# EasyEDA Pro project ProPrj_MOSSE_2026-03-25.epro, board PCB1
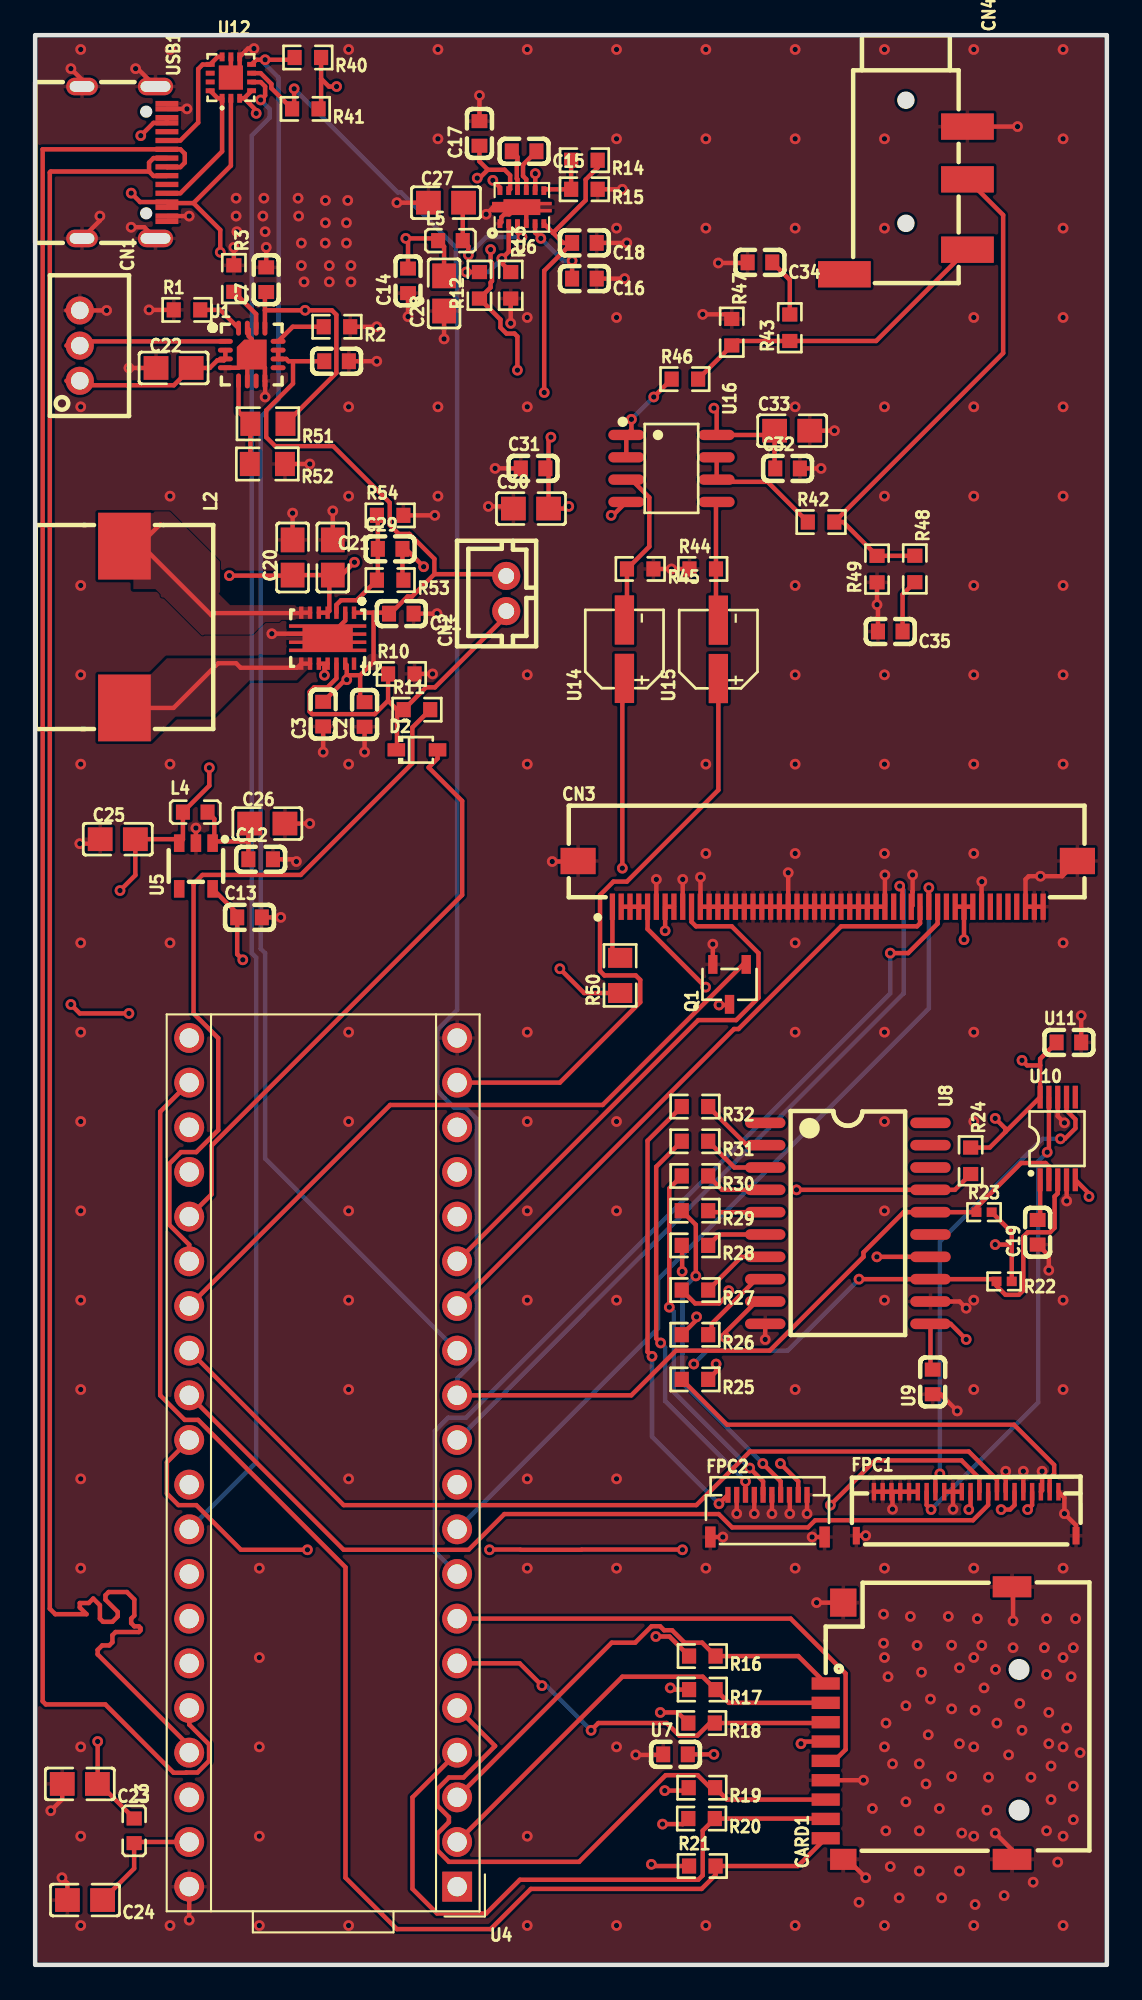
[diagram p9: board, top side]
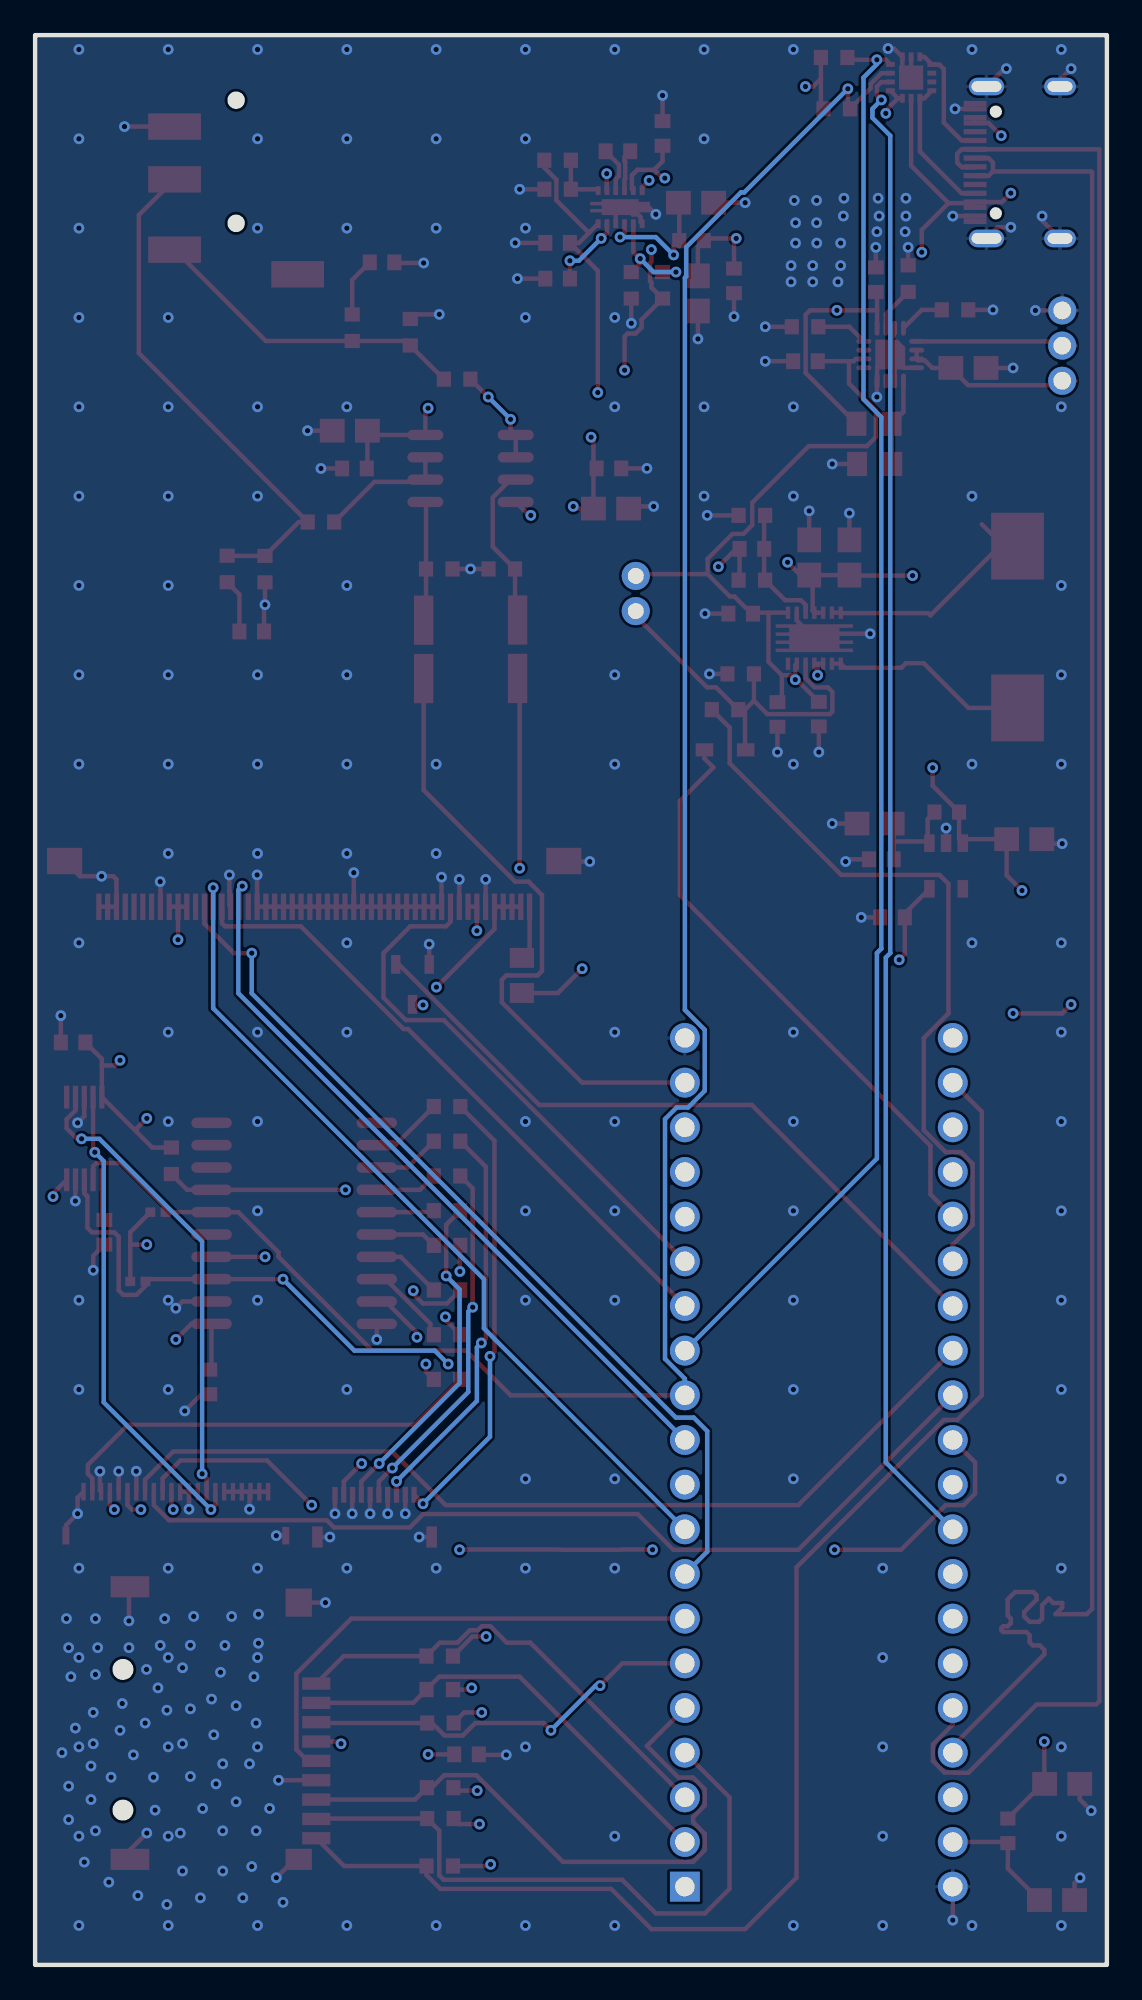
[diagram p10: board, bottom side, seen from below]

Outline 60.96 x 109.73 mm; copper layers: Top Layer, GND, Power, Bottom Layer. Coordinates in mm from the lower left corner of the outline.
Outline path: rectangle 0,109.73 60.96,0
Stack: Top Layer 0.035mm Outer layer thickness 1oz / Dielectric1 0.2104mm 7628 RC49% 8.6mil / GND 0.0152mm Inner layer thickness / Dielectric2 1.065mm 1.1mm H/HOZ Copper / Power 0.0152mm Inner layer thickness / Dielectric3 0.2104mm 7628 RC49% 8.6mil / Bottom Layer 0.035mm Outer layer thickness 1oz

## Design rules (mm)
net VSYS: Power_High
net +5V: Power_5V
net VBAT: Power_High
net $1N3188: Power_5V
net $1N3192: Power_5V
net VBUS: Power_High
net USB_D-: DP1
net USB_D+: DP1
net +3V3_DIGITAL: Power_3V3
net DAT3: SDIO_Bus
net DAT2: SDIO_Bus
net DAT1: SDIO_Bus
net DAT0: SDIO_Bus
net CMD: SDIO_Bus
net CLX: SDIO_Bus
net +4V5_ANALOG: Power_Analog
net -4V5_ANALOG: Power_Analog
net HAP_P: Diff_HAP
net HAP_N: Diff_HAP
net AGND: Ground
net AUDIO_L: Analog_Signal
net AUDIO_R: Analog_Signal
net $6N1003: Analog_Signal
net $6N1101: Analog_Signal
net $6N1422: Analog_Signal
net $6N1376: Analog_Signal
net $6N1353: Analog_Signal
net $6N1437: Analog_Signal
net $6N1331: Analog_Signal
net $6N1693: Analog_Signal
template: Custom Config
spacing copperThickness1oz (default): track to track 0.102, other pairs 0.152 to 0.3
spacing copperThickness2oz: track to track 0.203, other pairs 0.152 to 0.3
track width copperThickness1oz (default): min 0.127, default 0.254, max 2.54
track width copperThickness2oz: min 0.203, default 0.254, max 2.54
differential pair differentialPair (default): width min 0.127, default 0.254, max 2.54; gap min 0.152, default 0.152
via viaSize (default): diameter min 0.5, default 0.61, max 10; hole min 0.3, default 0.305, max 6.3
pour e92046 uses copperRegion

## Placement (name value [footprint] x y rotation side)
C1  4.7uF  [C0603]  17.15 91.19 180 top
C2  10uF  [C0603]  18.74 71.1 90 top
C3  10uF  [C0603]  16.38 71.12 90 top
C7  10uF  [C0603]  13.14 95.82 90 top
C11  100nF  [C0603]  20.83 76.84 180 top
C12  1uF  [C0603]  12.83 62.87 0 top
C13  2.2uF  [C0603]  12.19 59.56 0 top
C14  4.7uF  [C0603]  21.21 95.76 90 top
C15  2.2uF  [C0603]  27.81 103.12 180 top
C16  4.7uF  [C0603]  31.24 95.89 180 top
C17  2.2uF  [C0603]  25.27 104.14 90 top
C18  2.2uF  [C0603]  31.24 97.92 180 top
C19  1uF  [C0603]  57.02 41.66 90 top
C20  22uF  [C0805]  14.64 80.03 90 top
C21  22uF  [C0805]  16.93 80.03 90 top
C22  22uF  [C0805]  7.87 90.81 0 top
C23  10uF  [C0805]  2.54 10.29 180 top
C24  10uF  [C0805]  2.84 3.68 180 top
C25  10uF  [C0805]  4.7 64.01 0 top
C26  10uF  [C0805]  13.21 64.9 0 top
C27  10uF  [C0805]  23.37 100.2 0 top
C28  10uF  [C0805]  23.26 95.04 90 top
C29  10pF  [C0603]  20.19 80.52 0 top
C30  10uF  [C0805]  28.2 82.81 0 top
C31  100nF  [C0603]  28.32 85.09 0 top
C32  100nF  [C0603]  42.8 85.09 0 top
C33  10uF  [C0805]  43.06 87.24 0 top
C34  100nF  [C0603]  41.23 96.81 180 top
C35  100nF  [C0603]  48.64 75.82 180 top
CARD1  TF PUSH  [TF-SMD_TF-PUSH]  50.27 13.75 90 top
CN1  B3B-PH-K-S(LF)(SN)  [CONN-TH_B3B-PH-K-S]  2.54 92.08 270 top
CN2  B2B-PH-K-S(LF)(SN)  [CONN-TH_B2B-PH-K-S]  26.8 77.98 90 top
CN3  KH-FG0.5-H2.0-50PIN  [FPC-SMD_KH-FG0.5-H2.0-50PIN]  45.09 61.47 0 top
CN4  PJ-320D  [AUDIO-SMD_PJ-320D-1]  49.53 100.33 270 top
D2  1N4148WS  [SOD-323_L1.8-W1.3-LS2.5-RD]  21.72 69.09 0 top
FPC1  FH34SRJ-22S-0.5SH(50)  [FFC-SMD_22P-P0.50_HRS_FH34SRJ-22S-0.5SH]  52.96 25.65 0 top
FPC2  FH34SRJ-10S-0.5SH(50)  [FFC-SMD_10P-P0.50_FH34SRJ-10S-0.5SH]  41.66 25.53 0 top
L2  1.5uH  [IND-SMD_CYA1040-100UH]  5.08 76.07 270 top
L3  MPZ1608S102ATA00  [L0603]  5.63 7.62 270 top
L4  MPZ1608S102ATA00  [L0603]  9.11 65.55 0 top
L5  MPZ1608S102ATA00  [L0603]  23.62 98.04 0 top
Q1  AO3400A  [SOT-23-3_L3.0-W1.6-P1.90-LS2.8-BR]  39.5 55.75 90 top
R1  1kΩ  [R0603]  8.64 94.11 0 top
R2  1.13kΩ  [R0603]  17.17 93.15 180 top
R3  47kΩ  [R0603]  11.3 95.89 270 top
R10  220kΩ  [R0603]  20.83 73.41 0 top
R11  10kΩ  [R0603]  21.72 71.37 0 top
R12  274kΩ  [R0603]  25.27 95.5 90 top
R13  100kΩ  [R0603]  27.05 95.5 270 top
R14  270kΩ  [R0603]  31.24 102.62 180 top
R15  100kΩ  [R0603]  31.24 100.97 180 top
R16  10kΩ  [R0603]  37.95 17.56 180 top
R17  10kΩ  [R0603]  37.95 15.65 180 top
R18  10kΩ  [R0603]  37.91 13.75 180 top
R19  10kΩ  [R0603]  37.93 10.07 180 top
R20  10kΩ  [R0603]  37.91 8.32 180 top
R21  10kΩ  [R0603]  37.95 5.62 0 top
R22  2.2kΩ  [R0402]  55.12 38.86 180 top
R23  2.2kΩ  [R0402]  53.97 42.8 0 top
R24  4.7kΩ  [R0603]  53.21 45.72 270 top
R25  4.7kΩ  [R0603]  37.53 33.29 180 top
R26  4.7kΩ  [R0603]  37.53 35.83 180 top
R27  4.7kΩ  [R0603]  37.53 38.37 180 top
R28  4.7kΩ  [R0603]  37.53 40.91 180 top
R29  4.7kΩ  [R0603]  37.53 42.88 180 top
R30  4.7kΩ  [R0603]  37.53 44.86 180 top
R31  4.7kΩ  [R0603]  37.53 46.83 180 top
R32  4.7kΩ  [R0603]  37.53 48.81 180 top
R40  4.7kΩ  [R0603]  15.51 108.46 180 top
R41  4.7kΩ  [R0603]  15.37 105.54 180 top
R42  33Ω  [R0603]  44.7 82.04 0 top
R43  10Ω  [R0603]  42.93 93.09 90 top
R44  100kΩ  [R0603]  37.97 79.38 0 top
R45  100kΩ  [R0603]  34.42 79.38 180 top
R46  33Ω  [R0603]  36.96 90.17 0 top
R47  100kΩ  [R0603]  39.62 92.84 270 top
R48  10Ω  [R0603]  50.04 79.38 270 top
R49  100kΩ  [R0603]  47.89 79.37 90 top
R50  27Ω  [R0805]  33.27 56.26 90 top
R51  100kΩ  [R0805]  13.24 87.63 180 top
R52  33kΩ  [R0805]  13.21 85.34 180 top
R53  1.6MΩ  [R0603]  20.19 78.74 180 top
R54  180kΩ  [R0603]  20.19 82.42 0 top
U1  BQ24075RGTR  [QFN-16_L3.0-W3.0-P0.50-TL-EP1.7]  12.32 91.57 0 top
U2  TPS63020DSJR  [VSON-14_L4.0-W3.0-P0.50-BL-EP_TI_DSJ]  16.64 75.44 180 top
U4  -  [Daisy_Seed]  24 4.45 180 top
U5  AP2112K-3.3TRG1(MS)  [SOT-23-5_L2.9-W1.6-P0.95-LS2.7-BR]  9.14 62.48 90 top
U6  LM27762DSSR  [WSON-12_L3.0-W2.0-P0.50-BL-EP]  27.69 99.95 0 top
U7  100nF  [C0603]  36.43 11.97 0 top
U8  AT42QT2120-SUR  [SOIC-20_L12.8-W7.5-P1.27-LS10.3-BL]  46.23 42.16 270 top
U9  100nF  [C0603]  51.05 33.15 90 top
U10  DRV2605LDGSR  [VSSOP-10_L3.0-W3.0-P0.50-LS4.9-BL]  58.17 46.99 0 top
U11  100nF  [C0603]  58.8 52.45 0 top
U12  Fusb302mpx  [MLP-14_L2.5-W2.5-P0.50-BL-EP]  11.13 107.32 0 top
U14  10uF  [CAP-SMD_BD4.0-L4.3-W4.3-LS5.0-FD]  33.52 74.81 90 top
U15  10uF  [CAP-SMD_BD4.0-L4.3-W4.3-LS5.0-FD]  38.86 74.8 90 top
U16  OPA1642AIDR  [SOIC-8_L4.9-W3.9-P1.27-LS6.0-BL]  36.19 85.09 270 top
USB1  KH-TYPE-C-16P  [USB-C-SMD_KH-TYPE-C-16P]  5.08 102.49 270 top

## Footprints (pads in the part's own frame, mm; a bottom-side part is the same pattern mirrored in y, then rotated)
AUDIO-SMD_PJ-320D-1
  rect 1.5x3 smd: 1(4.2,-3.5) 2(-4.2,3.5) 3(-1.2,3.5) 4(2.8,3.5)
C0603
  rect 0.8x0.9 smd: 1(-0.7,0) 2(0.7,0)
C0805
  rect 1.41x1.35 smd: 1(-1,0) 2(1,0)
CAP-SMD_BD4.0-L4.3-W4.3-LS5.0-FD
  rect 2.8x1.1 smd: 1(-1.661,0) 2(1.661,0)
CONN-TH_B2B-PH-K-S
  round 1.6 hole 0.9: 1(1,0) 2(-1,0)
CONN-TH_B3B-PH-K-S
  round 1.6 hole 1: 1(2,0) 2(0,0) 3(-2,0)
Daisy_Seed
  rect 1.7x1.7 hole 1.1: 1(0,0)
  round 1.7 hole 1.1: 2(0,-2.54) 3(0,-5.08) 4(0,-7.62) 5(0,-10.16) 6(0,-12.7) 7(0,-15.24) 8(0,-17.78) 9(0,-20.32) 10(0,-22.86) 11(0,-25.4) 12(0,-27.94) 13(0,-30.48) 14(0,-33.02) 15(0,-35.56) 16(0,-38.1) 17(0,-40.64) 18(0,-43.18) 19(0,-45.72) 20(0,-48.26) 21(15.24,-48.26) 22(15.24,-45.72) 23(15.24,-43.18) 24(15.24,-40.64) 25(15.24,-38.1) 26(15.24,-35.56) 27(15.24,-33.02) 28(15.24,-30.48) 29(15.24,-27.94) 30(15.24,-25.4) 31(15.24,-22.86) 32(15.24,-20.32) 33(15.24,-17.78) 34(15.24,-15.24) 35(15.24,-12.7) 36(15.24,-10.16) 37(15.24,-7.62) 38(15.24,-5.08) 39(15.24,-2.54) 40(15.24,0)
FFC-SMD_10P-P0.50_FH34SRJ-10S-0.5SH
  rect 0.3x0.9 smd: 1(2.25,1.2) 2(1.75,1.2) 3(1.25,1.2) 4(0.75,1.2) 5(0.25,1.2) 6(-0.25,1.2) 7(-0.75,1.2) 8(-1.25,1.2) 9(-1.75,1.2) 10(-2.25,1.2)
  rect 0.6x1.2 smd: 11(-3.25,-1.2) 12(3.25,-1.2)
FFC-SMD_22P-P0.50_HRS_FH34SRJ-22S-0.5SH
  rect 0.25x1 smd: 1(5.25,1.25) 2(4.75,1.25) 3(4.25,1.25) 4(3.75,1.25) 5(3.25,1.25) 6(2.75,1.25) 7(2.25,1.25) 8(1.75,1.25) 9(1.25,1.25) 10(0.75,1.25) 11(0.25,1.25) 12(-0.25,1.25) 13(-0.75,1.25) 14(-1.25,1.25) 15(-1.75,1.25) 16(-2.25,1.25) 17(-2.75,1.25) 18(-3.25,1.25) 19(-3.75,1.25) 20(-4.25,1.25) 21(-4.75,1.25) 22(-5.25,1.25)
  rect 0.4x1 smd: 23(-6.25,-1.25) 24(6.25,-1.25)
FPC-SMD_KH-FG0.5-H2.0-50PIN
  rect 0.3x1.5 smd: 1(-12.25,-1.3) 2(-11.75,-1.3) 3(-11.25,-1.3) 4(-10.75,-1.3) 5(-10.25,-1.3) 6(-9.75,-1.3) 7(-9.25,-1.3) 8(-8.75,-1.3) 9(-8.25,-1.3) 10(-7.75,-1.3) 11(-7.25,-1.3) 12(-6.75,-1.3) 13(-6.25,-1.3) 14(-5.75,-1.3) 15(-5.25,-1.3) 16(-4.75,-1.3) 17(-4.25,-1.3) 18(-3.75,-1.3) 19(-3.25,-1.3) 20(-2.75,-1.3) 21(-2.25,-1.3) 22(-1.75,-1.3) 23(-1.25,-1.3) 24(-0.75,-1.3) 25(-0.25,-1.3) 26(0.25,-1.3) 27(0.75,-1.3) 28(1.25,-1.3) 29(1.75,-1.3) 30(2.25,-1.3) 31(2.75,-1.3) 32(3.25,-1.3) 33(3.75,-1.3) 34(4.25,-1.3) 35(4.75,-1.3) 36(5.25,-1.3) 37(5.75,-1.3) 38(6.25,-1.3) 39(6.75,-1.3) 40(7.25,-1.3) 41(7.75,-1.3) 42(8.25,-1.3) 43(8.75,-1.3) 44(9.25,-1.3) 45(9.75,-1.3) 46(10.25,-1.3) 47(10.75,-1.3) 48(11.25,-1.3) 49(11.75,-1.3) 50(12.25,-1.3)
  rect 2x1.5 smd: 51(14.2,1.3) 52(-14.2,1.3)
IND-SMD_CYA1040-100UH
  rect 3.8x3 smd: 1(-4.6,0) 2(4.6,0)
L0603
  rect 0.8x0.864 smd: 1(-0.7,0) 2(0.7,0)
MLP-14_L2.5-W2.5-P0.50-BL-EP
  rect 0.28x0.505 smd: 1(-0.5,-1.177) 2(0,-1.177) 3(0.5,-1.177) 8(0.5,1.177) 9(0,1.177) 10(-0.5,1.177)
  rect 0.505x0.28 smd: 4(1.177,-0.75) 5(1.177,-0.25) 6(1.177,0.25) 7(1.177,0.75) 11(-1.177,0.75) 12(-1.177,0.25) 13(-1.177,-0.25) 14(-1.177,-0.75)
  rect 1.375x1.375 smd: 15(0,0)
QFN-16_L3.0-W3.0-P0.50-TL-EP1.7
  oval 0.85x0.28 smd: 1(-1.5,0.75) 2(-1.5,0.25) 3(-1.5,-0.25) 4(-1.5,-0.75) 9(1.5,-0.75) 10(1.5,-0.25) 11(1.5,0.25) 12(1.5,0.75)
  oval 0.28x0.85 smd: 5(-0.75,-1.5) 6(-0.25,-1.5) 7(0.25,-1.5) 8(0.75,-1.5) 13(0.75,1.5) 14(0.25,1.5) 15(-0.25,1.5) 16(-0.75,1.5)
  custom 1.7x1.7 smd: 17(0,0)
R0402
  rect 0.566x0.54 smd: 1(-0.433,0) 2(0.433,0)
R0603
  rect 0.806x0.864 smd: 1(-0.753,0) 2(0.753,0)
R0805
  rect 1.133x1.377 smd: 1(-1,0) 2(1,0)
SOD-323_L1.8-W1.3-LS2.5-RD
  rect 1x0.75 smd: 1(-1.173,0) 2(1.173,0)
SOIC-8_L4.9-W3.9-P1.27-LS6.0-BL
  oval 0.588x2.045 smd: 1(-1.905,-2.57) 2(-0.635,-2.57) 3(0.635,-2.57) 4(1.905,-2.57) 5(1.905,2.57) 6(0.635,2.57) 7(-0.635,2.57) 8(-1.905,2.57)
SOIC-20_L12.8-W7.5-P1.27-LS10.3-BL
  oval 0.6x2.3 smd: 1(-5.715,-4.7) 2(-4.445,-4.7) 3(-3.175,-4.7) 4(-1.905,-4.7) 5(-0.635,-4.7) 6(0.635,-4.7) 7(1.905,-4.7) 8(3.175,-4.7) 9(4.445,-4.7) 10(5.715,-4.7) 11(5.715,4.7) 12(4.445,4.7) 13(3.175,4.7) 14(1.905,4.7) 15(0.635,4.7) 16(-0.635,4.7) 17(-1.905,4.7) 18(-3.175,4.7) 19(-4.445,4.7) 20(-5.715,4.7)
SOT-23-3_L3.0-W1.6-P1.90-LS2.8-BR
  rect 1.07x0.532 smd: 1(1.135,-0.95) 2(1.135,0.95) 3(-1.135,0)
SOT-23-5_L2.9-W1.6-P0.95-LS2.7-BR
  rect 1x0.6 smd: 1(1.3,-0.95) 2(1.3,0) 3(1.3,0.95) 4(-1.3,0.95) 5(-1.3,-0.95)
TF-SMD_TF-PUSH
  rect 0.7x1.6 smd: 1(2.25,5.3) 2(1.15,5.3) 3(0.05,5.3) 4(-1.05,5.3) 5(-2.15,5.3) 6(-3.25,5.3) 7(-4.35,5.3) 8(-5.45,5.3) CD(-6.55,5.3)
  rect 1.2x1.5 smd: 10(-7.75,4.3)
  rect 1.2x2.2 smd: 11(-7.75,-5.3) 12(7.75,-5.3)
  rect 1.6x1.5 smd: 13(6.85,4.3)
USB-C-SMD_KH-TYPE-C-16P
  oval 1x2 hole 0.6x1.7: 1(-4.32,1.765) 2(4.32,1.765)
  oval 1x1.8 hole 0.6x1.4: 3(-4.32,-2.415) 4(4.32,-2.415)
  rect 0.3x1.3 smd: A1(-3.35,2.415) A4(-2.55,2.415) A5(-1.25,2.415) A6(-0.25,2.415) A7(0.25,2.415) A8(1.25,2.415) A9(2.55,2.415) A12(3.35,2.415) B1(3.05,2.415) B4(2.25,2.415) B5(1.75,2.415) B6(0.75,2.415) B7(-0.75,2.415) B8(-1.75,2.415) B9(-2.25,2.415) B12(-3.05,2.415)
VSON-14_L4.0-W3.0-P0.50-BL-EP_TI_DSJ
  rect 0.25x0.7 smd: 1(-1.5,-1.45) 2(-1,-1.45) 3(-0.5,-1.45) 4(0,-1.45) 5(0.5,-1.45) 6(1,-1.45) 7(1.5,-1.45) 8(1.5,1.45) 9(1,1.45) 10(0.5,1.45) 11(0,1.45) 12(-0.5,1.45) 13(-1,1.45) 14(-1.5,1.45)
  custom 4.4x1.58 smd: 15(0,0)
VSSOP-10_L3.0-W3.0-P0.50-LS4.9-BL
  rect 0.3x1.3 smd: 1(-1,-2.35) 2(-0.5,-2.35) 3(0,-2.35) 4(0.5,-2.35) 5(1,-2.35) 6(1,2.35) 7(0.5,2.35) 8(0,2.35) 9(-0.5,2.35) 10(-1,2.35)
WSON-12_L3.0-W2.0-P0.50-BL-EP
  rect 0.28x0.5 smd: 1(-1.25,-0.94) 2(-0.75,-0.94) 3(-0.25,-0.94) 4(0.25,-0.94) 5(0.75,-0.94) 6(1.25,-0.94) 7(1.25,0.94) 8(0.75,0.94) 9(0.25,0.94) 10(-0.25,0.94) 11(-0.75,0.94) 12(-1.25,0.94)
  custom 3.4x0.9 smd: 13(0,0)

## Nets
As in the schematic.

Pads without a net: CN3 33 39 44 45 46 47; CN4 1; U1 7 9; U2 14; U4 1 10 16 17 21 33 34 35 38; U5 4; U8 1 15 18 19 20; U10 6; U12 12 13; USB1 A8 B8

## Via types
v1: diameter 0.61, hole 0.305, Top Layer to Bottom Layer, 398 vias

## Routing (per net, layer and track width the routed paths; a pad name or vN(x,y) marks a point on that pad's centre or on a via; arc(x,y) is an arc through that point)
+3V3_DIGITAL: length 139.1
  Top Layer w0.254: U12.3 11.88,106.14 ; 11.88,106.14 12.57,105.45 v1(12.57,105.28) ; 11.88,106.14 U12.4 ; v1(5.33,54.1) 2.54,54.1 v1(2.03,54.61) ; U5.5 11.49,59.79 C13.1 11.49,57.47 v1(11.81,57.15) ; R16.2 36.08,18.67 v1(35.31,18.67) ; R21.1 35.15,5.62 v1(35.05,5.72) ; R41.1 16.26,105.68 16.26,107.25 ; v1(59.94,43.69) 59.94,43.86 U10.5 ; v1(54.61,48.13) 55.19,47.55 55.19,47.36 ; 16.26,107.25 16.71,106.81 v1(17.15,106.81) ; 16.26,107.25 16.26,108.46 ; 57.17,51.14 56.43,51.14 v1(56.13,51.44) ; 57.17,51.14 U10.10 55.19,47.36 ; 57.17,51.14 57.17,51.52 U11.1 ; R20.2 36.84,8 v1(35.69,8) ; v1(43.56,12.57) 43.69,12.7 CARD1.4 ; R17.2 36.04,15.65 35.94,15.75 ; U7.2 v1(38.61,11.97) ; v1(35.81,9.91) 37,9.91 R19.2 ; v1(35.84,58.8) CN3.7 CN3.8 ; R24.1 54.3,46.47 55.19,47.36 ; U9.2 50.93,33.97 U8.11 52.07,36.45 v1(52.96,35.56) ; R18.2 36.55,14.35 v1(35.56,14.35) ; CN3.42 CN3.41 ; CN3.41 v1(52.84,58.29) ; CN3.41 CN3.40 ; R23.2 55.55,41.66 55.55,40.96 ; 55.55,40.96 R22.1 ; 55.55,40.96 v1(54.61,40.96)
  Power w0.254: 6.6,51.82 5.33,53.09 v1(5.33,54.1) ; 10.41,10.41 9.89,10.94 8.3,10.94 7.37,11.87 7.37,14.61 ; v1(11.81,57.15) 14.22,57.15 16,55.37 22.35,55.37 ; v1(2.03,54.61) 1.02,55.63 1.02,81.66 8.16,88.8 8.16,98.52 7.65,99.03 7.65,101.86 7.93,102.14 7.93,102.47 9.03,103.57 10.86,103.57 v1(12.57,105.28) 13.59,104.27 14.6,104.27 v1(17.15,106.81)
  vias: v1(36.13,15.75)
+4V5_ANALOG: length 36.7
  Top Layer w0.254: v1(25.91,97.54) 25.91,96.85 25.98,96.78 25.98,95.74 25.91,95.66 25.91,95.39 R12.1 26.47,93.56 26.47,93.1 26.81,92.76 27.26,92.76 27.43,92.59 v1(27.43,90.68) ; U6.11 27.02,100.97 27.02,101.76 26.7,102.08 25.75,102.08 ; 25.75,102.08 25.27,102.55 C17.1 ; 25.75,102.08 25.28,101.6 v1(25.15,101.6) ; v1(38.61,88.52) 38.76,88.36 U16.8 41.82,87 C33.1 42.06,85.13 C32.1
  Power w0.254: v1(27.43,90.68) 27.69,90.42 31.5,90.42 33.4,88.52 v1(38.61,88.52) ; v1(25.91,97.54) 25.15,98.3 25.15,99.22 25.07,99.3 25.07,99.78 25.15,99.86 v1(25.15,101.6)
+5V: length 167.3
  Top Layer w0.254: C14.2 21.21,98.04 v1(21.08,98.17) 22.79,98.17 L5.1 23.26,97.71 C28.2 ; C21.1 C20.1 14.61,78.99 v1(11.05,78.99) ; C21.1 17.43,79.03 v1(18.16,79.76) ; C21.1 16.73,78.83 16.73,76.98 U2.4 U2.5 ; R50.1 31.23,55.26 v1(29.84,56.64) ; v1(3.56,12.7) 3.56,10.3 C23.1 3.66,10.29 L3.1 ; v1(26.03,101.47) 26.44,101.07 U6.12 ; U6.8 28.45,100.9 v1(28.45,101.85) ; R53.1 20.89,78.79 C29.2 21.08,80.52 v1(22.1,79.5) ; v1(4.83,61.09) 5.7,61.96 C25.2 7.97,64.01 U5.3 8.41,64 L4.1 9.91,67.05 v1(9.91,68.07)
  Power w0.254: 11.05,67.95 v1(11.05,78.99) ; 11.05,67.95 10.92,68.07 v1(9.91,68.07) ; 11.05,67.95 11.05,66.42 10.92,66.29 ; v1(22.1,79.5) 21.46,78.87 19.05,78.87 v1(18.16,79.76) ; 26.16,92.2 25.63,92.2 25.45,92.38 25.2,92.38 25.02,92.2 25.02,82.04 25.53,81.53 29.08,81.53 30.09,80.52 30.09,71.62 25.78,67.31 21.08,67.31 15.62,61.85 15.62,61.6 20.57,56.64 v1(29.84,56.64) ; v1(3.56,12.7) 3.81,12.95 3.81,58.93
-4V5_ANALOG: length 29
  Top Layer w0.254: v1(30.35,82.93) 30.23,82.81 C30.2 29.2,86.73 v1(29.34,86.87) ; R14.1 32,102.2 31.31,101.51 31.31,100.34 29.46,98.49 ; U6.6 29.46,98.49 ; 29.46,98.49 30.03,97.92 C18.2 28.96,96.33 v1(28.96,89.41) ; v1(32.77,82.42) 32.86,82.42 U16.4
  Power w0.254: v1(29.34,86.87) 30.1,87.63 30.1,88.27 v1(28.96,89.41) ; v1(32.77,82.42) 32.64,82.3 32.26,82.3 31.88,82.68 30.61,82.68 v1(30.35,82.93)
AGND: length 163.2
  Top Layer w0.254: v1(58.55,47.88) 58.17,48.26 U10.8 ; C32.2 v1(44.7,85.09) ; CARD1.13 v1(44.45,20.6) ; FPC2.7 v1(40.91,25.65) ; CARD1.10 46.2,6 v1(47.24,4.95) ; FPC2.11 v1(39.12,24.33) ; CN3.51 58.42,61.9 v1(57.18,61.9) 56.51,61.9 56.34,61.72 CN3.48 CN3.49 CN3.50 ; v1(37.85,61.85) 37.85,60.18 CN3.11 CN3.12 CN3.13 CN3.14 CN3.15 CN3.16 CN3.17 CN3.18 CN3.19 CN3.20 CN3.21 ; FPC2.5 41.91,26.72 v1(41.91,25.65) ; U6.4 27.94,99.7 U6.13 27.38,99.95 ; CN4.2 v1(55.88,104.53) ; C28.1 v1(23.26,92.46) ; v1(2.54,63.75) 3.44,63.75 C25.1 ; U12.9 U12.15 11.63,107.82 U12.8 12.1,108.97 v1(12.45,108.97) ; U11.2 v1(59.5,53.98) ; FPC2.3 42.93,26.71 v1(42.93,25.65) ; v1(1.52,4.95) 1.84,4.64 C24.2 ; FPC2.1 v1(43.91,25.65) ; v1(52.45,31.5) 51.5,32.45 U9.1 ; R2.1 v1(19.43,93.15) ; v1(38.86,96.77) 40.49,96.77 C34.2 ; CARD1.11 55.57,6.53 v1(54.61,7.49) ; CN3.21 CN3.22 CN3.23 CN3.24 CN3.25 CN3.26 CN3.27 CN3.28 CN3.29 CN3.30 CN3.31 CN3.32 v1(48.34,61.98) ; CN3.21 v1(42.84,62.1) ; C7.2 v1(13.14,97.66) ; v1(37.97,93.85) 39.36,93.85 R47.1 ; v1(25.65,99.54) 26.06,99.95 27.38,99.95 ; C22.1 v1(5.33,90.81) ; C12.2 14.73,62.87 v1(14.86,62.74) ; U1.4 11.57,90.82 12.07,91.32 U1.6 ; v1(5.46,98.81) 6.21,98.81 USB1.2 ; C13.2 v1(13.97,59.56) ; v1(0.89,8.76) 1.54,9.41 C23.2 ; C31.1 v1(26.16,85.09) ; FPC2.9 v1(39.91,25.65) ; U6.1 26.52,99.09 26.52,99.38 26.68,99.54 26.97,99.54 27.38,99.95 ; USB1.B12 v1(8.64,105.54) ; R44.1 v1(36.19,79.38) R45.1 ; v1(49.91,61.98) 49.91,61.04 49.91,61.03 49.91,60.24 CN3.35 ; C26.2 v1(15.62,64.9) ; CN3.6 v1(35.34,61.72) ; v1(34.16,11.94) 35.69,11.94 35.72,11.97 ; C1.1 v1(19.43,91.19) ; FPC1.23 v1(47.24,24.4) ; R54.2 v1(22.73,82.42) ; v1(13.08,89.15) 13.08,90.06 U1.8 13.07,90.82 U1.17 12.32,92.44 12.15,92.61 12.15,92.99 U1.15 ; CARD1.12 55.63,21.44 v1(55.63,19.56) ; FPC1.14 FPC1.13 ; FPC1.13 FPC1.12 ; FPC1.13 v1(52.21,25.91) ; FPC1.1 58.55,26.57 v1(58.55,25.65) 59.21,24.99 FPC1.24 ; C3.1 v1(16.38,68.96) ; C14.1 v1(21.21,93.73) ; USB1.1 5.83,107.82 v1(5.72,107.82) ; FPC1.20 FPC1.21 FPC1.22 ; FPC1.20 48.77,26.85 v1(48.77,25.91) ; FPC1.20 FPC1.19 FPC1.18 FPC1.17 ; v1(25.78,82.93) 27.08,82.93 C30.1 ; R1.1 v1(6.48,94.11) ; C35.2 47.94,77.29 v1(47.89,77.34) R49.1 ; v1(57.28,28.07) 57.28,26.97 FPC1.3 ; C2.1 v1(18.74,68.96) ; v1(53.85,61.6) 53.84,61.58 CN3.43 ; FPC1.5 v1(56.21,28.07) ; U2.2 17.64,76.44 U2.15 16.38,75.69 v1(13.46,75.69) ; C18.1 v1(33.66,97.92) ; USB1.4 3.68,99.19 v1(3.68,99.44) ; v1(57.66,39.5) 57.66,40.32 C19.1 ; C16.1 v1(33.53,95.89) ; C11.1 v1(22.86,76.84) ; C21.2 v1(16.93,82.68) ; C27.1 v1(20.57,100.2) ; CARD1.6 v1(47.12,10.5) ; C17.2 v1(25.27,106.3) ; USB1.3 2.67,107.19 v1(2.03,107.82) ; v1(58.67,43.43) 58.67,44.63 U10.4 ; 1.78,94.08 v1(4.06,94.08) ; C33.2 v1(45.47,87.24) ; R3.1 v1(11.3,97.66) ; 8.76,4.45 v1(8.76,2.54) ; Q1.2 v1(38.55,58.04) ; v1(29.41,62.74) 30.85,62.74 30.88,62.77 ; CN3.9 v1(36.84,61.72) ; USB1.B1 v1(8.76,99.44) ; R52.1 v1(15.62,85.34) ; v1(52.96,37.34) 52.58,37.72 U8.12 ; R13.2 v1(27.05,93.35) ; R10.2 v1(22.61,73.41) ; C20.2 v1(14.64,82.55) ; U5.2 v1(9.14,64.64) ; U8.10 v1(41.53,35.56) ; FPC1.7 v1(55.21,28.07) ; R15.1 v1(33.4,100.97) ; FPC2.12 v1(44.2,24.33)
  vias: v1(2.59,108.92) v1(2.59,88.6) v1(2.59,78.44) v1(2.59,73.36) v1(2.59,68.28) v1(2.59,58.12) v1(2.59,53.04) v1(2.59,47.96) v1(2.59,42.88) v1(2.59,37.8) v1(2.59,32.72) v1(2.59,27.64) v1(2.59,22.56) v1(2.59,12.4) v1(2.59,7.31) v1(2.59,2.24) v1(7.67,108.92) v1(7.67,83.52) v1(7.67,68.28) v1(7.67,58.12) v1(7.67,2.24) v1(11.43,100.46) v1(11.43,99.44) v1(11.47,98.55) v1(12.75,22.56) v1(12.75,17.48) v1(12.75,12.4) v1(12.75,7.31) v1(12.75,2.24) v1(13.01,100.46) v1(12.95,99.44) v1(13.08,98.55) v1(14.96,100.46) v1(14.99,99.44) v1(15.14,97.91) v1(15.14,96.62) v1(15.3,95.7) v1(16.51,100.33) v1(16.51,99.06) v1(16.5,97.91) v1(16.73,96.62) v1(16.73,95.7) v1(17.71,99.06) v1(17.71,97.91) v1(17.83,108.92) v1(17.78,100.33) v1(17.83,88.6) v1(17.83,83.52) v1(17.83,68.28) v1(17.83,53.04) v1(17.83,47.96) v1(17.83,42.88) v1(17.83,37.8) v1(17.83,32.72) v1(17.83,27.64) v1(17.83,2.24) v1(17.96,96.62) v1(17.96,95.7) v1(22.91,108.92) v1(22.91,103.84) v1(22.91,88.6) v1(22.91,83.52) v1(27.99,108.92) v1(27.99,93.68) v1(27.99,88.6) v1(27.99,73.36) v1(27.99,68.28) v1(27.99,53.04) v1(27.99,47.96) v1(27.99,42.88) v1(27.99,37.8) v1(27.99,27.64) v1(27.99,22.56) v1(27.99,7.31) v1(27.99,2.24) v1(33.07,108.92) v1(33.07,103.84) v1(33.07,98.76) v1(33.07,93.68) v1(33.07,47.96) v1(33.07,42.88) v1(33.07,37.8) v1(33.07,27.64) v1(33.07,22.56) v1(33.07,12.4) v1(33.07,2.24) v1(38.15,108.92) v1(38.15,103.84) v1(38.15,98.76) v1(38.15,68.28) v1(38.15,63.2) v1(38.15,22.56) v1(38.15,2.24) v1(43.23,108.92) v1(43.23,103.84) v1(43.23,98.76) v1(43.23,88.6) v1(43.23,78.44) v1(43.23,73.36) v1(43.23,68.28) v1(43.23,63.2) v1(43.23,58.12) v1(43.23,53.04) v1(43.23,32.72) v1(43.23,22.56) v1(43.23,2.24) v1(46.86,3.56) v1(47.62,8.89) v1(48.31,108.92) v1(48.31,103.84) v1(48.31,98.76) v1(48.31,88.6) v1(48.31,83.52) v1(48.31,73.36) v1(48.31,68.28) v1(48.31,63.2) v1(48.31,53.04) v1(48.31,47.96) v1(48.31,42.88) v1(48.31,37.8) v1(48.31,22.56) v1(48.26,19.94) v1(48.26,18.29) v1(48.31,17.48) v1(48.31,12.4) v1(48.31,2.24) v1(48.4,13.75) v1(48.39,7.62) v1(48.51,16.38) v1(48.64,5.59) v1(48.77,11.43) v1(49.15,3.81) v1(49.53,14.73) v1(49.53,9.27) v1(49.78,19.81) v1(50.16,18.16) v1(50.29,11.43) v1(50.29,7.62) v1(50.29,5.33) v1(50.42,16.64) v1(50.67,10.29) v1(50.8,13.08) v1(50.93,15.11) v1(51.44,8.89) v1(51.56,3.81) v1(51.94,19.81) v1(52.13,18.17) v1(52.13,14.56) v1(52.13,10.71) v1(52.58,16.89) v1(52.58,12.57) v1(52.58,5.33) v1(52.71,7.49) v1(53.39,108.92) v1(53.39,93.68) v1(53.39,88.6) v1(53.39,83.52) v1(53.39,78.44) v1(53.39,73.36) v1(53.39,68.28) v1(53.39,63.2) v1(53.39,53.04) v1(53.39,47.96) v1(53.39,37.8) v1(53.39,32.72) v1(53.39,22.56) v1(53.39,17.48) v1(53.39,12.4) v1(53.39,7.31) v1(53.39,2.24) v1(53.47,14.48) v1(53.47,3.43) v1(53.59,19.69) v1(53.85,18.16) v1(53.97,15.75) v1(54.14,8.8) v1(54.23,10.67) v1(54.63,16.8) v1(54.7,13.75) v1(55.12,3.94) v1(55.37,11.94) v1(55.63,18.03) v1(56.01,14.86) v1(56.13,13.34) v1(56.64,10.67) v1(56.77,4.7) v1(57.4,18.03) v1(57.53,19.69) v1(57.53,16.51) v1(57.53,7.62) v1(57.66,14.35) v1(57.66,12.57) v1(57.78,11.3) v1(57.78,9.4) v1(58.17,5.84) v1(58.47,108.92) v1(58.47,103.84) v1(58.47,98.76) v1(58.47,93.68) v1(58.47,88.6) v1(58.47,83.52) v1(58.47,78.44) v1(58.47,73.36) v1(58.47,68.28) v1(58.47,58.12) v1(58.47,37.8) v1(58.47,32.72) v1(58.47,22.56) v1(58.47,17.48) v1(58.47,12.4) v1(58.47,7.31) v1(58.47,2.24) v1(58.67,13.46) v1(58.93,16.38) v1(59.06,18.03) v1(59.06,10.16) v1(59.06,8.25) v1(59.18,19.69) v1(59.44,12.06)
VBAT: length 10.3
  Top Layer w0.254: 1.78,90.08 2.03,89.82 7.89,89.82 C22.2 9.93,90.81 10.36,91.24 10.74,91.24 U1.3 U1.2
VBUS: length 39.8
  Top Layer w0.254: U12.2 11.13,102.31 9,100.18 ; USB1.A4 USB1.B9 6.73,104.74 v1(6.01,104.01) ; 9,100.18 7.73,100.18 ; 9,100.18 10.53,98.66 v1(10.53,97.39) ; 7.73,100.18 USB1.B4 5.97,100.24 v1(5.46,100.75) ; 7.73,100.18 USB1.A9 ; 13.07,94.08 13.07,95.05 C7.1 ; 13.07,94.08 v1(15.35,94.08) 16.88,94.08 17.13,93.83 17.13,90.52 R51.1 ; 13.07,94.08 U1.13
  Power w0.254: v1(15.35,94.08) 13.83,94.08 v1(10.53,97.39) ; v1(6.01,104.01) 5.46,103.47 v1(5.46,100.75)
AUDIO_L: length 29.5
  Top Layer w0.254: v1(33.4,62.36) 33.4,73.03 U14.1
  Power w0.254: 24,47.63 33.4,57.02 v1(33.4,62.36)
AUDIO_R: length 35.9
  Top Layer w0.254: 24,50.17 29.84,50.17 34.42,54.74 34.42,56.01 34.16,56.26 32.38,56.26 32.13,56.52 32.13,60.83 32.89,61.6 33.66,61.6 38.86,66.8 U15.1
BTN_E: length 61.9
  Top Layer w0.25: 27.61,23.6 31.08,23.6 ; 31.09,23.61 36.81,23.61 ; v1(15.49,23.6) 11.7,23.6 9.16,26.14 8.15,26.14 7.49,26.8 7.49,28.58 8.76,29.84 ; v1(45.23,26.14) 47.77,28.68 52.69,28.68 53.71,27.67 FPC1.10 ; 25.86,23.61 27.6,23.61
  Power w0.25: v1(15.49,23.6) v1(25.84,23.6) 27.61,23.6 27.6,23.61 ; 31.09,23.61 31.08,23.6 v1(36.82,23.6) 42.44,23.6 43.71,24.87 43.96,24.87 v1(45.23,26.14)
BTN_N: length 52.2
  Top Layer w0.25: 8.76,34.93 17.55,26.14 37.61,26.14 40.66,29.19 53.11,29.19 54.71,27.59 FPC1.8
BTN_S: length 51.5
  Top Layer w0.25: FPC1.9 54.21,26.14 53.34,25.28 44.37,25.28 43.96,24.87 39.64,24.87 38.88,25.63 26.69,25.63 24.66,23.6 17.55,23.6 8.76,32.39
BTN_W: length 46.6
  Top Layer w0.25: v1(53.11,25.89) 53.21,25.99 FPC1.11
  Power w0.25: 8.76,27.31 9.93,26.14 24.66,26.14 25.42,26.9 52.09,26.9 v1(53.11,25.89)
CC1: length 6.9
  Top Layer w0.254: U12.10 10.38,108.49 U12.11 9.95,108.06 9.53,108.06 9.27,107.8 9.27,104.76 8.26,103.74 USB1.A5
CC2: length 8
  Top Layer w0.254: U12.14 10.38,106.14 U12.1 10.63,103.12 8.26,100.74 USB1.B5
CLX: length 29.1
  Top Layer w0.254: 24,19.69 42.98,19.69 46.1,16.56 46.1,12.24 45.46,11.6 CARD1.5
CMD: length 23.3
  Top Layer w0.254: v1(28.83,15.88) 27.56,17.15 U4.6 ; v1(31.62,13.34) 32.04,13.75 35.92,13.75 36.64,13.04 37.67,13.04 38.38,13.75 R18.1 44.92,13.75 44.97,13.8
  Bottom Layer w0.254: v1(31.62,13.34) 29.08,15.88 v1(28.83,15.88)
DAT0: length 36.4
  Top Layer w0.254: U4.5 26.16,12.45 24.37,10.65 23.54,10.65 22.87,9.99 22.87,9.06 23.54,8.4 23.54,8.11 22.87,7.45 22.87,6.52 23.54,5.86 30.94,5.86 35.87,10.78 37.69,10.78 38.4,10.07 R19.1 39.35,9.4 CARD1.7
DAT1: length 36.6
  Top Layer w0.254: 44.97,8.3 44.95,8.32 R20.1 37.97,7.63 37.97,5.09 37.72,4.84 27.57,4.84 25.65,2.92 22.86,2.92 21.46,4.32 21.46,9.53 24,12.06
DAT2: length 26.3
  Top Layer w0.254: CARD1.1 43.41,17.56 R16.1 37.94,18.32 36.94,18.32 36.23,19.03 35.78,19.03 35.55,19.25 35.06,19.25 34.13,18.32 32.8,18.32 24,9.53
DAT3: length 25.5
  Top Layer w0.254: CARD1.2 39.46,14.9 R17.1 37.97,16.38 33.4,16.38 U4.2
DISP_CS: length 51.5
  Top Layer w0.254: v1(48.64,57.53) 49.66,57.53 51.34,59.21 CN3.38
  Bottom Layer w0.254: v1(48.64,57.53) 48.64,55.25 24.51,31.12 23.5,31.12 22.73,30.35 22.73,23.5 U4.8
DISP_DC: length 36.3
  Top Layer w0.254: 24,37.47 39.75,53.21 40,53.21 45.85,59.06 50.16,59.06 50.34,59.23 CN3.36
DISP_PWM: length 39.7
  Top Layer w0.254: 8.76,37.47 20.19,48.9 32.28,48.9 40.27,56.89 Q1.1
DISP_RST: length 31.3
  Top Layer w0.254: 24,40.01 37.72,53.72 39.88,53.72 41.15,54.99 41.15,57.53 39.62,59.06 37.59,59.06 37.34,59.31 CN3.10
FUSB_INT: length 85.3
  Top Layer w0.254: 12.32,107.06 12.83,107.06 13.08,106.81 13.08,106.3 v1(12.83,106.05)
  Bottom Layer w0.254: 8.76,24.77 12.57,28.58 12.57,57.28 12.32,57.53 12.32,104.01 13.34,105.03 13.34,105.54 v1(12.83,106.05)
GPIO_OFF: length 42.9
  Top Layer w0.254: R11.2 21.45,70.36 21.45,68.33 15.1,61.98 9.52,61.98 9.01,61.47 9.01,54.1 10.41,52.7 10.41,47.46 9.16,46.21 8.3,46.21 7.63,45.55 7.63,42.08 8.76,40.95 8.76,40.01
GPIO_ON: length 34
  Top Layer w0.254: D2.2 22.89,68.6 22.38,68.09 24.29,66.18 24.29,60.83 10.03,46.58 10.03,43.82 8.76,42.55
HAP_N: length 27.3
  Top Layer w0.25: v1(57.57,46.21) 57.67,46.31 U10.9 ; FPC1.16 50.71,26.14 v1(50.96,25.89)
  Bottom Layer w0.25: v1(57.57,46.21) 57.06,45.7 57.06,31.98 v1(50.96,25.89)
HAP_P: length 26.7
  Top Layer w0.25: U10.7 58.67,48.59 59.17,48.08 59.17,47.57 58.57,46.97 v1(58.32,46.97) ; v1(51.46,27.92) 51.21,27.67 FPC1.15
  Bottom Layer w0.25: v1(58.32,46.97) 57.31,46.97 51.46,41.13 v1(51.46,27.92)
NTC: length 9.1
  Top Layer w0.254: U1.1 2.02,92.32 1.78,92.08
SCL: length 125.2
  Top Layer w0.254: U12.6 12.82,107.57 13.44,106.95 13.44,106.71 R41.2 14.73,105.66 v1(14.73,106.68) ; U10.2 57.67,45.4 57.47,45.59 56.08,45.59 53.54,43.05 R23.1 U8.16 49.4,42.8 47.12,40.51 47.12,40.26 41.78,34.93 36.45,34.93 33.91,32.39 24,32.39
  Bottom Layer w0.254: v1(14.73,106.68) 20.62,100.79 20.82,100.79 23.93,97.68 23.93,96.02 24,95.94 24,54.3 22.87,53.17 22.87,49.7 23.82,48.75 24.47,48.75 25.13,48.09 25.13,34.46 24,33.33 24,32.39
SD_CD: length 81.7
  Top Layer w0.254: CARD1.CD 43.39,5.62 R21.2 38.7,5.11 37.91,4.32 28.19,4.32 25.91,2.03 20.57,2.03 17.65,4.95 17.65,22.6 9.27,30.99 8.51,30.99 7.11,32.38 7.11,48.51 8.76,50.17
SDA: length 124.6
  Top Layer w0.254: v1(46.86,38.99) 54.56,38.99 R22.2 54.69,38.61 55.19,38.1 55.96,38.1 56.21,38.35 56.21,41.4 56.46,41.66 57.73,41.66 57.99,41.91 57.99,43.69 58.17,43.87 U10.3 ; R40.2 14.63,108.33 v1(13.08,108.33) 12.57,108.33 U12.7
  Power w0.254: v1(37.47,34.16) 37.21,33.91 25.02,33.91 24,34.93
  Bottom Layer w0.254: v1(37.47,34.16) 38.23,34.93 42.8,34.93 v1(46.86,38.99) ; v1(13.08,108.33) 13.08,108.08 13.84,107.32 13.84,89.03 12.83,88.01 12.83,57.79 13.08,57.53 13.08,45.85 24,34.93
SNS0: length 24.8
  Top Layer w0.25: FPC1.2 57.71,27.67 57.96,27.92 57.96,28.43 55.68,30.71 39.35,30.71 R25.2
SNS1: length 28.1
  Top Layer w0.25: FPC1.4 56.71,26.14 v1(56.46,25.89) ; R26.2 37.62,36.68 v1(37.62,36.85)
  Power w0.25: v1(37.62,36.85) 37.62,37.35 39.4,39.13 43.21,39.13 v1(56.46,25.89)
SNS2: length 25.7
  Top Layer w0.25: v1(39.45,38.33) 39.45,38.15 38.91,37.61 37.54,37.61 R27.2 ; FPC1.6 55.71,26.14 55.46,25.89 v1(54.95,25.89)
  Power w0.25: v1(39.45,38.33) 42.5,38.33 v1(54.95,25.89)
SNS3: length 16.9
  Top Layer w0.254: v1(36.8,39.43) 36.8,40.89 R28.2 ; v1(42.39,28.5) 43.41,27.49 FPC2.2
  Power w0.254: v1(42.39,28.5) 38.07,32.82 38.07,34.6 36.8,35.87 v1(36.8,39.43)
SNS4: length 19.1
  Top Layer w0.254: v1(41.39,28.5) 42.41,27.49 FPC2.4 ; v1(37.58,39.17) 37.58,42.08 R29.2
  Bottom Layer w0.254: v1(37.58,39.17) 36.82,38.41 36.82,33.08 v1(41.39,28.5)
SNS5: length 20.6
  Top Layer w0.254: v1(36.07,37.4) 36.07,44.15 R30.2 ; FPC2.6 41.41,27.49 v1(40.64,28.25)
  Bottom Layer w0.254: v1(36.07,37.4) 36.33,37.14 36.33,32.57 v1(40.64,28.25)
SNS6: length 22.8
  Top Layer w0.254: FPC2.8 v1(40.41,27.49) ; R31.2 35.33,45.38 35.33,35.62 v1(35.58,35.36)
  Bottom Layer w0.254: v1(35.58,35.36) 35.83,35.11 35.83,32.06 v1(40.41,27.49)
SNS7: length 25.8
  Top Layer w0.254: FPC2.10 v1(38.9,26.22) ; v1(35.09,34.6) 34.83,34.86 34.83,46.86 R32.2
  Bottom Layer w0.254: v1(38.9,26.22) 35.09,30.03 v1(35.09,34.6)
SPI_MOSI: length 43.3
  Top Layer w0.254: CN3.34 49.34,61.18 v1(49.18,61.34)
  Bottom Layer w0.254: v1(49.18,61.34) 49.4,61.12 49.4,55.25 24,29.84
SPI_SCK: length 48.7
  Top Layer w0.254: v1(50.84,61.25) CN3.37
  Bottom Layer w0.254: v1(50.84,61.25) 50.84,54.39 35.43,38.99 35.43,36.2 U4.9
TOUCH_CHANGE: length 46.5
  Top Layer w0.254: v1(43.31,44.07) 52.32,44.07 R24.2
  Power w0.254: v1(43.31,44.07) 43.05,43.82 12.57,43.82 8.76,47.63
TOUCH_RESET: length 47.7
  Top Layer w0.254: v1(47.88,40.26) U8.14
  Power w0.254: v1(47.88,40.26) 46.86,41.28 8.25,41.28 7.49,42.04 7.49,43.82 8.76,45.09
USB_D+: length 113.2
  Top Layer w0.254: USB1.B6 7.48,101.72 6.73,101.72 6.48,101.98 ; 6.48,101.98 6.48,102.49 6.73,102.74 USB1.A6 ; 6.48,101.98 0.89,101.98 0.83,101.92 0.83,20.25 1.14,19.94 2.92,19.94 2.54,20.32 2.54,20.57 3.05,20.57 3.3,20.83 3.68,20.45 3.68,19.69 3.86,19.51 4.39,19.51 4.7,19.81 4.7,20.07 4,20.76 4,21.02 4.18,21.2 5.22,21.2 5.64,20.78 5.64,19.86 5.46,19.69 5.46,19.43 5.64,19.25 5.89,19.25 5.99,19.16 5.99,19.02 5.89,18.92 4.57,18.92 4.39,18.74 4.39,18.34 4.21,18.16 3.81,18.16 3.56,17.91 3.56,17.65 8.76,12.45 8.76,12.06
USB_D-: length 113
  Top Layer w0.254: USB1.A7 7.51,102.22 8.26,102.22 8.51,102.48 8.51,102.99 8.26,103.24 USB1.B7 0.43,103.24 0.43,14.99 0.61,14.81 3.99,14.81 7.87,10.92 8.58,10.92 8.6,10.94 9.23,10.94 9.89,11.6 9.89,12.53 8.76,13.66 8.76,14.61
VSYS: length 43.5
  Top Layer w0.25: 14.67,91.19 14.67,89.92 13.14,88.39 13.14,86.87 13.65,86.36 16.95,86.36 20.17,83.14 20.17,81.87 20.68,81.37 21.29,81.37 22.71,79.95 22.71,79.08 21.44,77.81 21.19,77.81 20.26,76.89 19.25,76.89 ; 19.25,76.89 U2.1 ; 19.25,76.89 19.25,74.09 18.49,73.33 17.72,73.33 ; 17.72,73.33 v1(17.72,73.08) 17.64,73.08 C3.2 ; 17.72,73.33 17.72,73.9 U2.13 ; U2.10 U2.11 16.45,73.8 v1(16.45,73.33)
  Top Layer w0.254: 18.74,71.8 18.49,72.05 18.49,73.33 ; U1.11 U1.10 14.28,91.32 14.41,91.19 16.44,91.19 ; CN2.1 26.69,79.08 22.71,79.08
  Power w0.25: v1(17.72,73.08) 16.71,73.08 v1(16.45,73.33)
$1N2216: length 2.6
  Top Layer w0.254: R1.2 10.53,94.11 U1.16
$1N2243: length 2.9
  Top Layer w0.254: R2.2 14.65,93.15 U1.12
$1N2252: length 2.6
  Top Layer w0.254: R3.2 12.57,93.87 U1.14
$1N2345: length 5
  Top Layer w0.254: R52.2 12.24,85.38 R51.2 11.57,88.3 U1.5
$1N3188: length 11.8
  Top Layer w0.25: U2.9 U2.8 14.91,73.76 11.68,73.76 11.43,74.01 10.41,74.01 7.87,71.47 L2.2
$1N3192: length 13.8
  Top Layer w0.25: 6.1,80.67 10.03,76.74 10.16,76.86 15.11,76.86 U2.7 U2.6
  Top Layer w0.254: 7.11,81.92 5.87,80.67 L2.1
$1N3331: length 7.1
  Top Layer w0.254: U2.3 17.14,77.34 17.4,77.6 18.3,77.6 R53.2 19.49,78.79 19.49,82.37 R54.1
$1N5284: length 21.9
  Top Layer w0.25: R10.1 20.07,71.88 19.31,71.12 15.76,71.12 15.61,71.27 15.61,72.39 15.87,72.64 16.63,72.64 17.14,73.15 U2.12
  Top Layer w0.254: 20.07,71.88 20.58,71.37 ; 20.58,71.37 20.58,69.13 D2.1 ; 20.58,71.37 R11.1 22.23,72.64 22.74,72.64 26.8,76.7 CN2.2
$1N7346: length 6
  Top Layer w0.254: C26.1 12.13,64.82 12.13,63.88 ; 12.13,63.88 10.19,63.88 ; 12.13,63.88 C12.1 ; 10.19,63.88 10.19,65.16 9.81,65.55 ; 10.19,63.88 U5.1
$1N7688: length 2.4
  Top Layer w0.254: U6.10 27.44,101.53 27.4,101.57 27.4,102.51 27.44,102.55 27.44,102.8 C15.2
$1N7694: length 2.6
  Top Layer w0.254: C15.1 27.75,102.36 27.75,101.72 27.94,101.54 U6.9
$1N7763: length 4.3
  Top Layer w0.254: v1(28.76,98.17) 28.44,98.5 U6.5 ; C16.2 v1(30.54,96.9)
  Bottom Layer w0.254: v1(30.54,96.9) 30.03,96.9 v1(28.76,98.17)
$1N7997: length 6.2
  Top Layer w0.254: U6.2 26.94,97.41 v1(26.54,97.02) 26.54,96.77 R13.1 ; R12.2 v1(24.51,96.26)
  Bottom Layer w0.254: v1(26.54,97.02) 25.78,96.26 v1(24.51,96.26)
$1N8179: length 3.2
  Top Layer w0.254: R14.2 R15.2 29.01,100.97 U6.7
$1N9576: length 7.5
  Top Layer w0.254: U6.3 27.44,98.5 v1(27.69,98.25) ; v1(24.64,97.23) 24.64,97.72 L5.2 24.32,100.16 C27.2
  Bottom Layer w0.254: v1(24.64,97.23) 25.66,98.25 v1(27.69,98.25)
$3N2452: length 7.1
  Top Layer w0.254: 8.76,6.99 5.69,6.99 L3.2 5.63,5.48 C24.1
$4N1113: length 9.4
  Top Layer w0.254: CN3.2 CN3.3 CN3.4 CN3.5 34.84,58.9 v1(38.14,55.6) ; Q1.3 39.46,54.58 v1(38.9,54.58)
  Power w0.254: v1(38.14,55.6) 38.14,55.34 v1(38.9,54.58)
$4N1278: length 3.1
  Top Layer w0.254: R50.2 32.84,57.7 CN3.1
$5N2187: length 4.2
  Top Layer w0.254: U8.2 40.48,46.61 R32.1
$5N2192: length 3.9
  Top Layer w0.254: R31.1 39.78,45.34 U8.3
$5N2197: length 3.6
  Top Layer w0.254: R30.1 39.07,44.07 41.53,44.07
$5N2202: length 3.3
  Top Layer w0.254: U8.5 38.37,42.8 R29.1
$5N2207: length 3.5
  Top Layer w0.254: U8.6 38.9,41.53 R28.1
$5N2212: length 4
  Top Layer w0.254: U8.7 40.17,40.26 R27.1
$5N2217: length 4.8
  Top Layer w0.254: R26.1 38.48,36.03 38.48,36.45 41.02,38.99 41.53,38.99
$5N2222: length 6.1
  Top Layer w0.254: v1(39.24,35.69) 39.24,35.94 41.02,37.72 U8.9 ; v1(38.73,34.16) 38.73,33.74 R25.1
  Power w0.254: v1(39.24,35.69) 39.24,34.67 v1(38.73,34.16)
$5N2566: length 2.3
  Top Layer w0.254: U10.1 57.17,42.5 C19.2
$6N1003: length 9.3
  Top Layer w0.254: 33.62,84.46 33.92,84.46 34.93,83.44 34.93,80.65 R45.2 33.66,76.62 U14.2
$6N1101: length 5.5
  Top Layer w0.254: U16.2 U16.1 33.92,87.29 v1(33.92,87.88) ; R46.1 v1(35.19,89.15)
  Bottom Layer w0.254: v1(35.19,89.15) v1(33.92,87.88)
$6N1331: length 6.8
  Top Layer w0.254: U15.2 38.73,76.6 R44.2 38.73,83.15 U16.5
$6N1353: length 7.5
  Top Layer w0.254: R42.1 41.66,84.33 38.89,84.33 38.76,84.46 U16.7
$6N1376: length 18.4
  Top Layer w0.254: R46.2 R47.2 39.88,92.34 R43.1 47.84,92.34 CN4.4
$6N1422: length 29.7
  Top Layer w0.254: R48.1 50.03,80.12 R49.2 45.97,82.04 R42.2 55.06,91.65 55.06,99.5 CN4.3
$6N1437: length 3.4
  Top Layer w0.254: R43.2 42.93,95.81 C34.1
$6N1693: length 3.1
  Top Layer w0.254: C35.1 49.34,77.92 R48.2

## Copper pours and planes (outline as drawn; the poured copper is in the pictures)
+3V3_DIGITAL on Power: 9.02,55.88 4.83,51.69 4.83,33.15 6.35,31.62 6.35,15.24 9.91,11.68 9.91,7.87 16.89,0.89 57.53,0.89 60.71,4.06 60.71,54.74 60.83,54.86 49.78,54.86 46.48,51.56 28.96,51.56 24.64,55.88
+3V3_DIGITAL on Power: 32,61.09 53.9,61.09 55.34,62.52 56.65,61.21 58.17,61.21 59.31,60.07 59.31,56.26 59.88,55.69 59.88,50.5 42.62,50.5 42.42,50.29 30.1,50.29 29.59,49.78 29.59,58.67
+5V on Power: 1.65,66.8 11.3,66.8 12.06,67.56 12.45,67.56 16.26,63.75 16.26,60.45 13.46,57.66 2.16,57.66 1.52,58.29 1.52,66.68
+5V on Power: 20.96,91.95 19.94,92.96 19.94,102.74 24.38,107.19 30.99,107.19 35.94,102.24 35.94,95.5 32,91.57 23.11,91.57 22.73,91.95
+5V on Power: 21.08,67.63 29.08,67.63 29.08,66.17 21.08,66.17
+5V on Power: 17.15,67.06 28.96,67.06 28.96,56.26 17.15,56.26
AGND on Top Layer: 53.72,21.59 54.86,22.73 60.07,22.73 60.45,22.35 60.45,5.81 59.97,5.32 58.28,5.32 55.63,2.67 45.34,2.67 45.09,2.92 45.09,5.72 46.48,7.11 46.48,11.67 46.99,12.18 46.99,17.78 44.96,19.81 43.81,19.81 43.05,20.57 43.05,21.34 43.31,21.59
AGND on Top Layer: -5.08,122.56 68.45,122.56 68.45,-7.49 -5.08,-7.49
AGND on Top Layer: 11.05,97.79 14.06,97.79 14.19,97.66 14.19,95.16 14.22,95.12 18.8,95.12 18.92,95.25 18.92,101.09 11.05,101.09
AGND on Bottom Layer: -9.27,117.35 75.95,117.35 75.95,-15.24 -9.27,-15.24
AGND on GND: 0.26,109.47 60.7,109.47 60.7,0.26 0.26,0.26
VSYS on Power: 11.56,82.93 11.56,71.5 15.11,67.95 25.78,67.95 29.08,71.25 29.08,81.28 25.4,81.28 22.61,84.07 17.4,84.07 16.38,83.06 11.68,83.06
$1N3188 on Top Layer: 6.22,74.38 15.62,74.38 15.62,69.6 6.22,69.6
$1N3192 on Top Layer: 5.59,82.55 7.62,82.55 7.62,78.23 5.59,78.23
$1N3192 on Top Layer: 6.48,82.55 7.62,82.55 10.41,79.76 10.41,78.11 10.29,77.98 11.05,77.22 15.64,77.22 15.64,76.69 15.75,76.58 13.97,76.58 13.84,76.45 13.03,76.45 12.32,75.74 9.57,75.74 9.53,75.69 7.37,77.85 7.24,77.85 7.24,77.98 5.08,80.14 5.08,80.67 6.48,82.07

Small or netless copper shapes (teardrops, artwork), in the pictures only: 1 on Top Layer, 27 on GND
